# EAGLE design Ryan and Jimmy Schematic AttemptTEST (EAGLE 9.2.2)
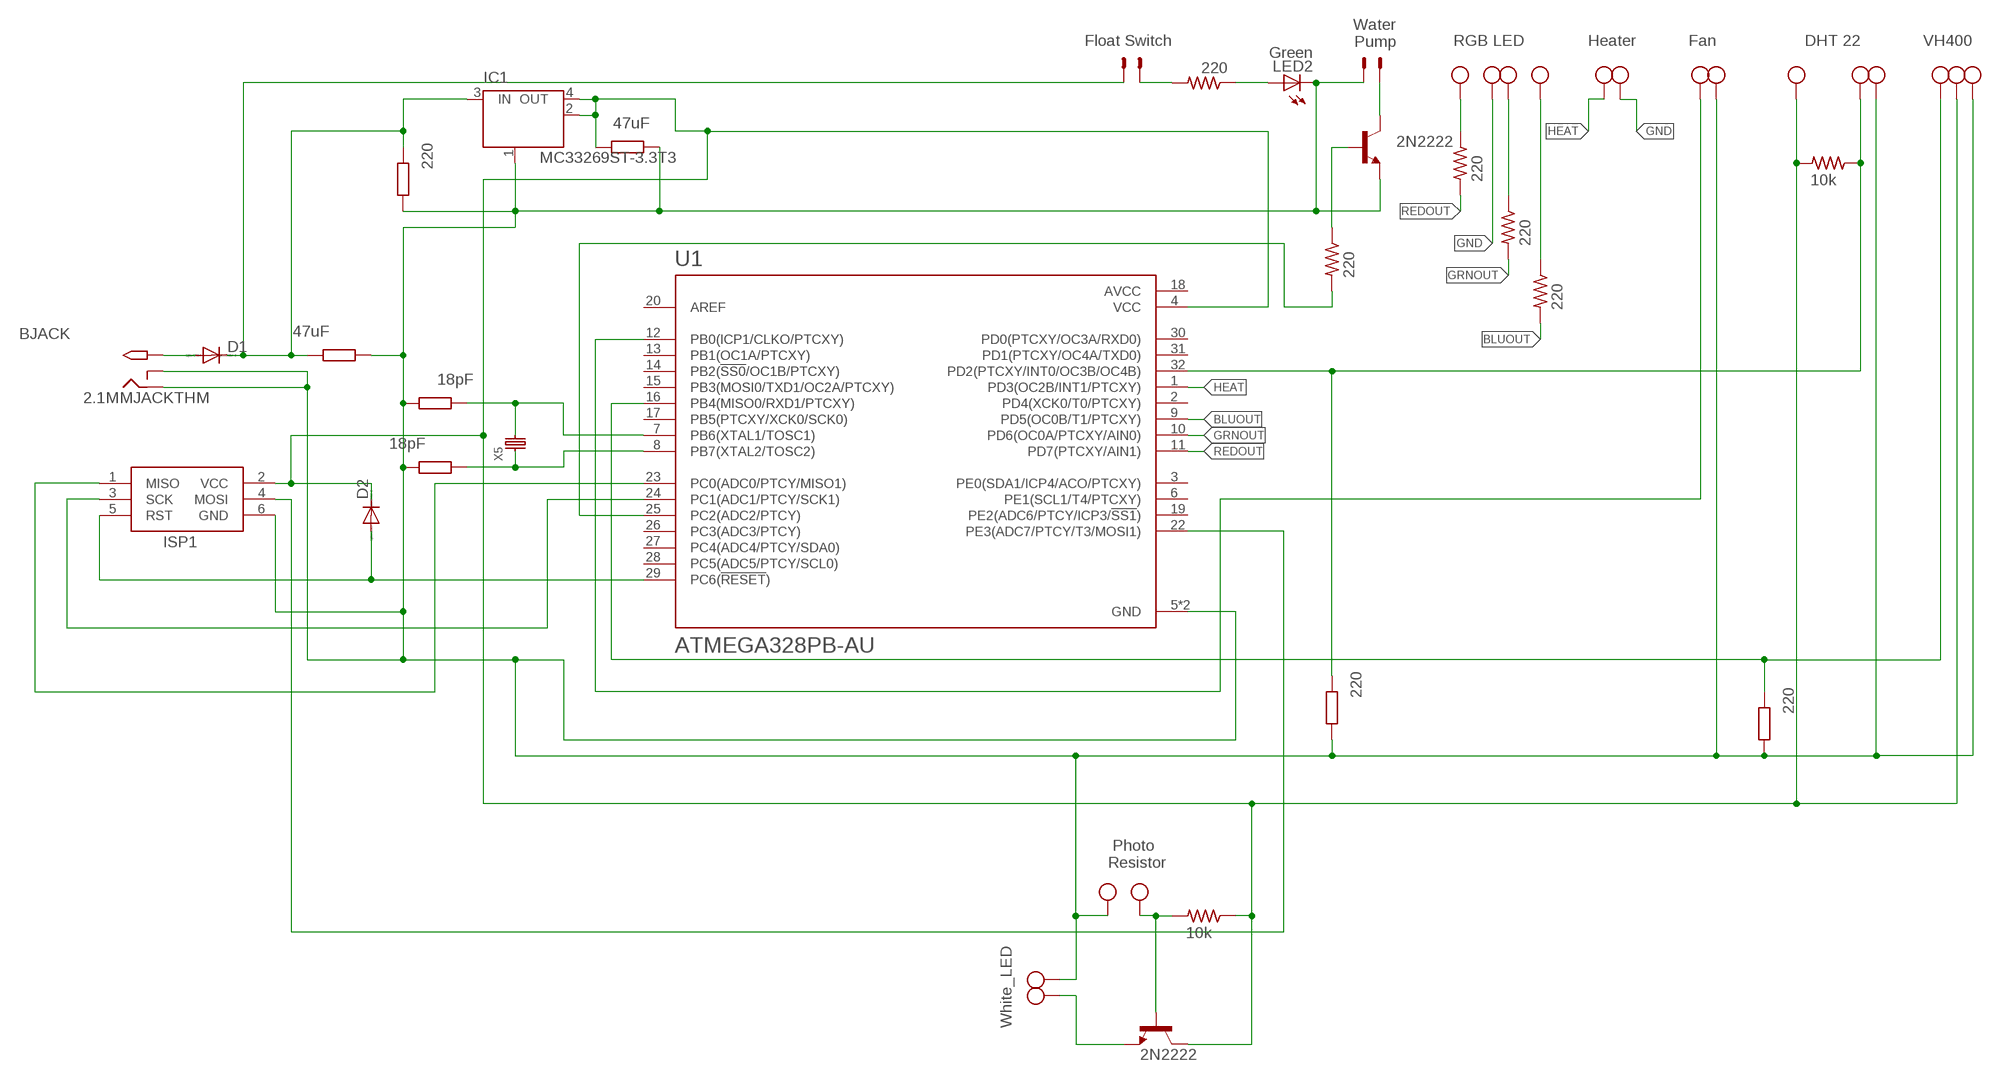
[diagram p0: schematic, sheet 1]

## Parts
BJACK  2.1MMJACKTHM  [PJ-102A]
C1  220  R-EU_M0805  [M0805]
C3  47uF  R-EU_M0805  [M0805]
C6  220  R-EU_M0805  [M0805]
C8  47uF  R-EU_M0805  [M0805]
C9  18pF  R-EU_M0805  [M0805]
C11  220  R-EU_M0805  [M0805]
C12  18pF  R-EU_M0805  [M0805]
D1  DIODE-DO214BA  [DO214BA]
D2  DIODE-DO214BA  [DO214BA]
IC1  MC33269ST-3.3T3  [SOT223]
ISP1  AVRISP-6  [AVRISP]
LED2  Green  LEDCHIPLED_0805  [CHIPLED_0805]
R1  220  R-US_R0805  [R0805]
R2  220  R-US_R0805  [R0805]
R3  10k  R-US_R0805  [R0805]
R4  220  R-US_R0805  [R0805]
R6  220  R-US_R0805  [R0805]
R7  220  R-US_R0805  [R0805]
R8  10k  R-US_R0805  [R0805]
T1  2N2222  [TO18]
T2  2N2222  [TO18]
U1  ATMEGA328PB-AU  [QFP80P900X900X120-32N]
X1  1X03_5MM_SCREW  [W237-103]
X2  1X02_5MM_SCREW  [W237-102]
X3  1X03_5MM_SCREW  [W237-103]
X4  1X02_5MM_SCREW  [W237-102]
X5  ECS-80-18-5PX-TR  [HC49/US]
X6  1X02_5MM_SCREW  [W237-102]
X7  W237-4  [W237-4]
X8  1X02_5MM_SCREW  [W237-102]
X9  332-02  [332-02]
X10  332-02  [332-02]

## Nets
5V: C3.2 D2.C IC1.2(OUT) IC1.4(OUT) ISP1.2(VCC) R3.1 R8.2 T2.3(C) U1.4(VCC) X1.3 X3.2
B: R7.1 X7.1
BLUOUT: R7.2 U1.9(PD5(OC0B/T1/PTCXY))
DHT: C6.2 R8.1 U1.32(PD2(PTCXY/INT0/OC3B/OC4B)) X1.2
F_S: R1.2 X10.1
FAN: U1.12(PB0(ICP1/CLKO/PTCXY)) X8.2
G: R6.1 X7.2
GND: BJACK.RING BJACK.RING_SW C1.1 C3.1 C6.1 C8.1 C9.2 C11.1 C12.2 IC1.1(GND/ADJ) ISP1.6(GND) LED2.C T1.1(E) U1.5(GND) U1.21(GND) X1.1 X2.2 X3.1 X4.1 X6.2 X7.3 X8.1 X9.1
GRNOUT: R6.2 U1.10(PD6(OC0A/PTCXY/AIN0))
HEAT: U1.1(PD3(OC2B/INT1/PTCXY)) X4.2
MISO: ISP1.1(MISO) U1.23(PC0(ADC0/PTCY/MISO1))
MOSI: ISP1.4(MOSI) U1.22(PE3(ADC7/PTCY/T3/MOSI1))
N$19: LED2.A R1.1
P_CON: R4.1 T1.2(B)
PHOTO: R3.2 T2.2(B) X2.1
POUT: R4.2 U1.25(PC2(ADC2/PTCY))
PUMP: T1.3(C) X9.2
PWRIN: BJACK.TIP D1.A
R: R2.1 X7.4
REDOUT: R2.2 U1.11(PD7(PTCXY/AIN1))
RESET: D2.A ISP1.5(RST) U1.29(PC6(!RESET!))
SCK: ISP1.3(SCK) U1.24(PC1(ADC1/PTCY/SCK1))
VH400: C11.2 U1.16(PB4(MISO0/RXD1/PTCXY)) X3.3
VIN: C1.2 C8.2 D1.C IC1.3(IN) X10.2
WHT_LED: T2.1(E) X6.1
XTAL1: C9.1 U1.7(PB6(XTAL1/TOSC1)) X5.P$2(XOUT)
XTAL2: C12.1 U1.8(PB7(XTAL2/TOSC2)) X5.P$1(XIN)
Unconnected: U1.2(PD4(XCK0/T0/PTCXY)) U1.3(PE0(SDA1/ICP4/ACO/PTCXY)) U1.6(PE1(SCL1/T4/PTCXY)) U1.13(PB1(OC1A/PTCXY)) U1.14(PB2(!SS0!/OC1B/PTCXY)) U1.15(PB3(MOSI0/TXD1/OC2A/PTCXY)) U1.17(PB5(PTCXY/XCK0/SCK0)) U1.19(PE2(ADC6/PTCY/ICP3/!SS1!)) U1.20(AREF) U1.26(PC3(ADC3/PTCY)) U1.27(PC4(ADC4/PTCY/SDA0)) U1.28(PC5(ADC5/PTCY/SCL0)) U1.30(PD0(PTCXY/OC3A/RXD0)) U1.31(PD1(PTCXY/OC4A/TXD0))

## Notes on the sheet
- Water
  Pump
- Float Switch | RGB LED | Heater | Fan | DHT 22 | VH400
- Photo
  Resistor
- White_LED

## Power pins joined to a net without a drawn wire
AVCC: U1.18(AVCC)

## Library data of the parts
BJACK = ECE388:2.1MMJACK: 2.1mm x 5.5mm THM DC jack with internal switch. Digikey part #PJ-102A, 4UCON part #05537 2.1mm x 5.5mm SMT DC jack with internal switch. Digikey part #PJ-002A-SMT, 4UCON part #03267 By microbuilder.eu & adafruit.com
C1 C3 C6 C8 C9 C11 C12 = resistor:R-EU_: RESISTOR, European symbol
D1 D2 = diode:DIODE-: DIODE
IC1 = linear:MC33269ST*: Adjustable Output Low Dropout Voltage Regulator 800 mA Source: http://www.onsemi.com/pub/Collateral/MC33269-D.PDF
ISP1 = ECE388:AVRISP: AVR ISP HEADER Standard 6 pin header for AVR programming
LED2 = led:LED: LED OSRAM: - CHIPLED LG R971, LG N971, LY N971, LG Q971, LY Q971, LO R971, LY R971 LH N974, LH R974 LS Q976, LO Q976, LY Q976 LO Q996 - Hyper CHIPLED LW Q18S LB Q993, LB Q99A, LB R99A - SideLED LS A670, LO A670, LY A670, LG A670, LP A670 LB A673, LV A673, LT A673, LW A673 LH A674 LY A675 LS A676, LA A676, LO A676, LY A676, LW A676 LS A679, LY A679, LG A679 - Hyper Micro SIDELED® LS Y876, LA Y876, LO Y876, LY Y876 LT Y87S - SmartLED LW L88C, LW L88S LB L89C, LB L89S, LG L890 LS L89K, LO L89K, LY L89K LS L896, LA L896, LO L896, LY L896 - TOPLED LS T670, LO T670, LY T670, LG T670, LP T670 LSG T670, LSP T670, LSY T670, LOP T670, LYG T670 LG T671, LOG T671, LSG T671 LB T673, LV T673, LT T673, LW T673 LH T674 LS T676, LA T676, LO T676, LY T676, LB T676, LH T676, LSB T676, LW T676 LB T67C, LV T67C, LT T67C, LS T67K, LO T67K, LY T67K, LW E67C LS E67B, LA E67B, LO E67B, LY E67B, LB E67C, LV E67C, LT E67C LW T67C LS T679, LY T679, LG T679 LS T770, LO T770, LY T770, LG T770, LP T770 LB T773, LV T773, LT T773, LW T773 LH T774 LS E675, LA E675, LY E675, LS T675 LS T776, LA T776, LO T776, LY T776, LB T776 LHGB T686 LT T68C, LB T68C - Hyper Mini TOPLED® LB M676 - Mini TOPLED Santana® LG M470 LS M47K, LO M47K, LY M47K Source: http://www.osram.convergy.de LUXEON: - LUMILED® LXK2-PW12-R00, LXK2-PW12-S00, LXK2-PW14-U00, LXK2-PW14-V00 LXK2-PM12-R00, LXK2-PM12-S00, LXK2-PM14-U00 LXK2-PE12-Q00, LXK2-PE12-R00, LXK2-PE12-S00, LXK2-PE14-T00, LXK2-PE14-U00 LXK2-PB12-K00, LXK2-PB12-L00, LXK2-PB12-M00, LXK2-PB14-N00, LXK2-PB14-P00, LXK2-PB14-Q00 LXK2-PR12-L00, LXK2-PR12-M00, LXK2-PR14-Q00, LXK2-PR14-R00 LXK2-PD12-Q00, LXK2-PD12-R00, LXK2-PD12-S00 LXK2-PH12-R00, LXK2-PH12-S00 LXK2-PL12-P00, LXK2-PL12-Q00, LXK2-PL12-R00 Source: www.luxeon.com KINGBRIGHT: KA-3528ASYC Source: www.kingbright.com
R1-R4 R6-R8 = rcl:R-US_: RESISTOR, American symbol; SPICEPREFIX: R
T1 T2 = transistor-neu-to92:2N2222: NPN TRANSISTOR
U1 = ATMEGA328PB-AU:ATMEGA328PB-AU: ATmega Series 20 MHz 32 KB Flash 2 KB SRAM 8-Bit Microcontroller - TQFP-32; AVAILABILITY: Unavailable; DESCRIPTION: AVR microcontroller; EEPROM: 1024B; SRAM: 2kB; Flash: 32kB; TQFP32; MF: Microchip; MP: ATMEGA328PB-AU; PACKAGE: TQFP-32 Microchip; PRICE: None
X1 X3 = ECE388:1X03_5MM_SCREW: WAGO SCREW CLAMP; MPN: 237-103; OC_FARNELL: unknown; OC_NEWARK: 18M7116
X2 X4 X6 X8 = ECE388:1X02_5MM_SCREW: WAGO SCREW CLAMP; MPN: 237-102; OC_FARNELL: unknown; OC_NEWARK: 70K9898
X5 = ECE388:ECS-80-18-5PX-TR
X7 = con-wago-500:W237-4: WAGO SCREW CLAMP; OC_FARNELL: unknown; OC_NEWARK: unknown
X9 X10 = con-garry:332-02: 2 Pin - 2mm Dual Row Source: www.mpe-connector.de / garry_shortform_2012.pdf

## Board
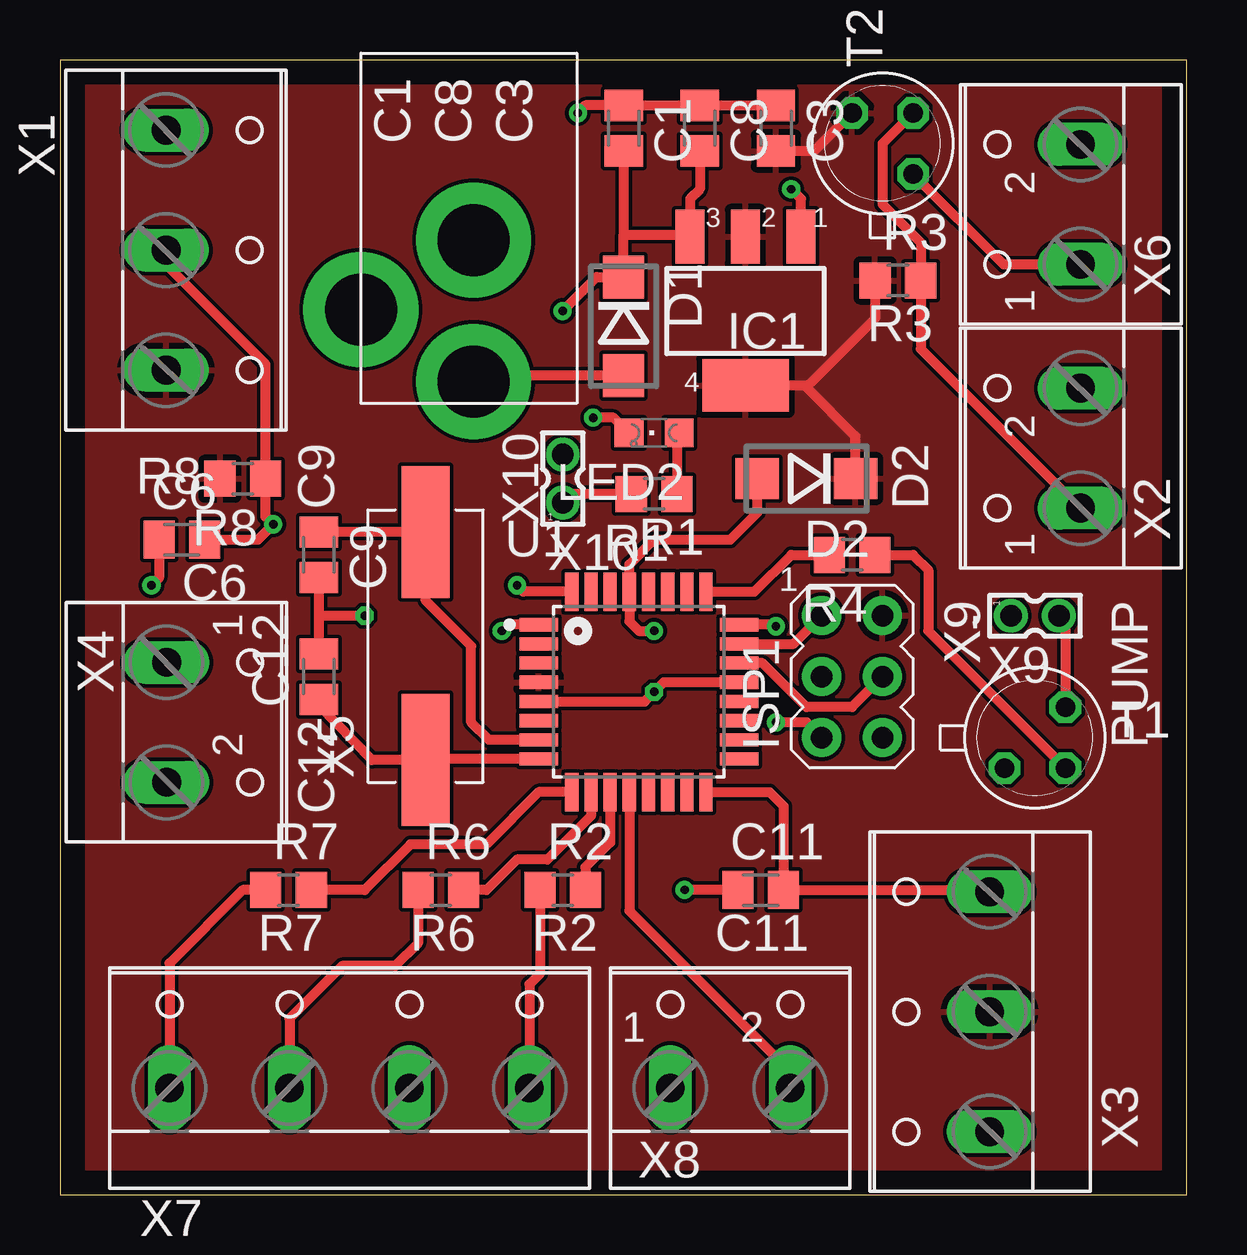
[diagram p1: board, top side]
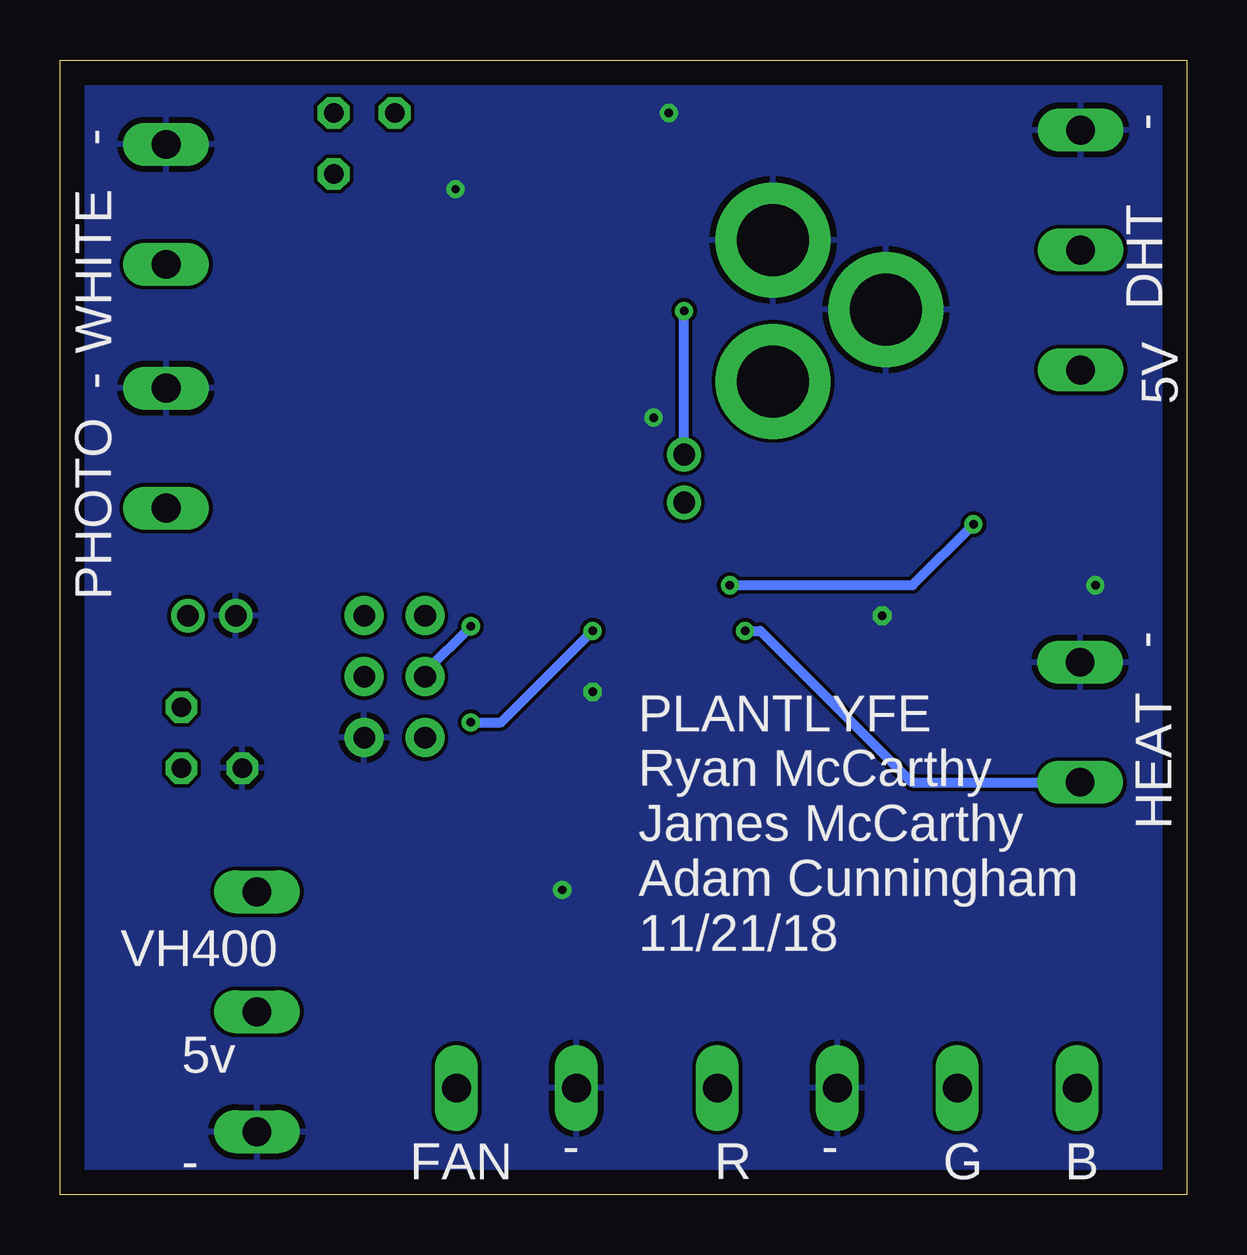
[diagram p2: board, bottom side, seen from below]

Size 46.97 x 47.3 mm. Coordinates in mm from the lower left corner, seen from the top.
Outline: 0,0 46.97,0 46.97,47.3 0,47.3 0,0
Copper layers (1*16): Top 0.035mm / dielectric 1.5mm / Bottom 0.035mm
Design rules "default": minimum track width 6mil, minimum drill 0.35mm, track to track 6mil, track to pad 6mil, pad to pad 6mil, via to via 6mil, smd to smd 6mil, copper to edge 40mil, drill to drill 6mil, minimum pad ring 10mil, minimum via ring 8mil, stop-mask expansion 4mil, vias tented up to drill 0mil, thermal gap 10mil

### Footprints (pad centres in the part's own frame; a part is rotated, then mirrored left to right if it is on the bottom)
PJ-102A = drill 3 pad 4.8: RING 0.1,-3.39; RING_SW -4.6,-6.29; TIP 0.1,-9.29
M0805 = smd 1.3 x 1.6: 1 -0.95,0; 2 0.95,0
DO214BA = smd 1.8 x 1.7: A 2.05,0; C -2.05,0
SOT223 = smd 1.219 x 2.235: 1 -2.311,-3.099; 2 0,-3.099; 3 2.311,-3.099 | smd 3.6 x 2.2: 4 0,3.099
AVRISP = drill 0.9 pad 1.626: 1 -1.27,2.54; 2 1.27,2.54; 3 -1.27,0; 4 1.27,0; 5 -1.27,-2.54; 6 1.27,-2.54
CHIPLED_0805 = smd 1.2 x 1.2: A 0,-1.05; C 0,1.05
R0805 = smd 1.3 x 1.5: 1 -0.95,0; 2 0.95,0
TO18 = drill 0.813 octagon: 1 -1.27,-1.27; 2 1.27,-1.27; 3 1.27,1.27
QFP80P900X900X120-32N = smd 1.6 x 0.55: 1 -4.18,2.8; 2 -4.18,2; 3 -4.18,1.2; 4 -4.18,0.4; 5 -4.18,-0.4; 6 -4.18,-1.2; 7 -4.18,-2; 8 -4.18,-2.8; 17 4.18,-2.8; 18 4.18,-2; 19 4.18,-1.2; 20 4.18,-0.4; 21 4.18,0.4; 22 4.18,1.2; 23 4.18,2; 24 4.18,2.8 | smd 0.55 x 1.6: 9 -2.8,-4.18; 10 -2,-4.18; 11 -1.2,-4.18; 12 -0.4,-4.18; 13 0.4,-4.18; 14 1.2,-4.18; 15 2,-4.18; 16 2.8,-4.18; 25 2.8,4.18; 26 2,4.18; 27 1.2,4.18; 28 0.4,4.18; 29 -0.4,4.18; 30 -1.2,4.18; 31 -2,4.18; 32 -2.8,4.18
W237-103 = drill 1.194 long: 1 -5,-1.29; 2 0,-1.29; 3 5,-1.29
W237-102 = drill 1.194 long: 1 -2.5,-1.27; 2 2.5,-1.27
HC49/US = smd 5.5 x 2: P$1 -4.75,0; P$2 4.75,0
W237-4 = drill 1.194 long: 1 -7.5,-1.27; 2 -2.5,-1.27; 3 2.5,-1.27; 4 7.5,-1.27
332-02 = drill 0.9 pad 1.27: 1 0,-1; 2 0,1

### Placement (x,y rotation side)
BJACK  17.14,43.18 0 top
C1  23.5,44.45 270 top
C3  29.84,44.45 270 top
C6  5.08,27.3 0 top
C8  26.67,44.45 270 top
C9  10.79,26.67 270 top
C11  29.21,12.7 0 top
C12  10.79,21.59 90 top
D1  23.5,36.2 270 top
D2  31.11,29.85 180 top
IC1  28.57,36.83 180 top
ISP1  33.02,21.59 0 top
LED2  24.77,31.75 90 top
R1  24.77,29.21 180 top
R2  20.95,12.7 0 top
R3  34.92,38.1 0 top
R4  33.02,26.67 180 top
R6  15.88,12.7 0 top
R7  9.53,12.7 0 top
R8  7.62,29.85 180 top
T1  40.64,19.05 0 top
T2  34.29,43.82 90 top
U1  24.13,20.95 0 top
X1  5.71,39.37 270 top
X2  41.27,31.11 90 top
X3  37.47,7.62 90 top
X4  5.71,19.68 270 top
X5  15.24,22.86 90 top
X6  41.27,41.28 90 top
X7  12.06,5.72 0 top
X8  27.94,5.72 0 top
X9  40.64,24.13 270 top
X10  20.95,29.85 0 top

### Tracks (layer width: path | path; a pad name or v marks a point on that pad's centre or on a via)
5V
  Top 0.406: T2.3 31.43,43.5 C3.2 | D2.C 33.16,31.61 31.11,33.66 | IC1.4 31.04,33.73 31.11,33.66 | R3.1 33.98,36.52 31.11,33.66
  pour Top: -1.27,49.53 46.99,49.53 46.99,0 -1.27,0
B
  Top 0.406: R7.1 7.62,12.7 4.57,9.64 X7.1
BLUOUT
  Top 0.406: R7.2 12.7,12.7 14.61,14.61 17.78,14.61 19.95,16.77 U1.9
DHT  (via drill 0.35)
  Top 0.406: U1.32 19.32,25.13 v19.05,25.4 | C6.2 8.26,27.3 v8.89,27.94 8.57,28.26 R8.1 8.57,34.61 4.42,38.76 X1.2
  Bottom 0.406: v19.05,25.4 11.43,25.4 v8.89,27.94
F_S
  Top 0.406: R1.2 21.32,29.21 X10.1
FAN
  Top 0.406: U1.12 23.73,11.83 30.44,5.12 X8.2
G
  Top 0.406: X7.2 9.56,7.34 11.75,9.52 13.97,9.52 14.93,10.48 R6.1
GND  (via drill 0.35)
  Top 0.406: U1.21 25.16,21.36 v24.77,20.95 24.36,20.55 U1.5 | 10.79,23.5 C12.2 10.79,24.13 | 10.79,24.13 C9.2 | 10.79,24.13 v12.7,24.13 | 30.96,40.01 IC1.1 30.89,41.5 v30.48,41.91 | C3.1 C8.1 C1.1 21.91,45.4 v21.59,45.09 | C11.1 v26.04,12.7 | LED2.C 23.08,32.39 v22.23,32.39 | C6.1 4.13,25.72 v3.81,25.4
  pour Bottom: -3.17,46.99 46.35,46.99 46.35,0 -3.17,0
GRNOUT
  Top 0.406: U1.10 22.13,15.78 20.32,13.97 19.05,13.97 17.78,12.7 R6.2
HEAT  (via drill 0.35)
  Top 0.406: U1.1 18.68,23.75 v18.41,23.5
  Bottom 0.406: v18.41,23.5 17.78,23.5 11.47,17.18 X4.2
MISO
  Top 0.406: ISP1.1 30.57,22.95 U1.23
MOSI
  Top 0.406: ISP1.4 33.02,20.32 31.11,20.32 29.28,22.15 U1.22
N$19
  Top 0.406: LED2.A 25.71,31.65 R1.1
P_CON
  Top 0.406: R4.1 35.56,26.67 36.2,26.04 36.2,23.5 T1.2
PHOTO
  Top 0.406: T2.2 34.29,43.82 34.29,41.28 35.88,39.69 R3.2 35.88,35.25 42.51,28.61 X2.1
POUT
  Top 0.406: U1.25 28.95,25.13 30.48,26.67 R4.2
PUMP
  Top 0.406: X9.2 41.91,23.86 T1.3
PWRIN
  Top 0.406: D1.A 17.5,34.15 BJACK.TIP
R
  Top 0.406: R2.1 20,9.21 19.57,8.77 X7.4
REDOUT
  Top 0.406: U1.11 22.93,14.68 21.91,13.65 R2.2
RESET  (via drill 0.35)
  Top 0.406: v24.77,23.5 24.13,23.5 23.73,23.89 U1.29 23.73,26.27 24.77,27.3 27.94,27.3 29.07,28.43 D2.A | ISP1.5 31.11,19.68 v29.84,19.68
  Bottom 0.406: v29.84,19.68 28.57,19.68 v24.77,23.5
SCK  (via drill 0.35)
  Top 0.406: v29.84,23.69 29.78,23.75 U1.24
  Bottom 0.406: v29.84,23.69 31.75,21.78 ISP1.3
VH400
  Top 0.406: X3.3 38.67,12.7 C11.2 30.16,16.2 29.58,16.77 U1.16
VIN  (via drill 0.35)
  Top 0.406: 23.5,40.01 D1.C 22.37,38.25 v20.95,36.83 | 23.5,40.01 26.26,40.01 IC1.3 26.26,41.5 26.67,41.91 C8.2 | C1.2 23.5,40.01
  Bottom 0.406: X10.2 v20.95,36.83
WHT_LED
  Top 0.406: T2.1 39.33,38.78 X6.1
XTAL1
  Top 0.406: U1.7 17.88,18.95 17.14,19.68 17.14,22.86 15.24,24.77 X5.P$2 10.8,27.61 C9.1
XTAL2
  Top 0.406: C12.1 10.79,20.39 13.01,18.11 X5.P$1 15.29,18.15 U1.8
(copper drawn outside any net)
  shapes: Top area x1

### Text on the board
tPlace: C1 | C8 | C3 | R3 | X10 | R8 | C9 | D2 | R1 | C6 | PUMP | - | X9 | C12 | R7 | R6 | R2 | C11
bPlace: - | - | WHITE | DHT | 5V | - | PHOTO | - | HEAT | PLANTLYFE / Ryan McCarthy / James McCarthy / Adam Cunningham / 11/21/18 | VH400 | 5v | B | G | - | R | - | FAN | -